# EAGLE design mirror watchwinder (EAGLE 8.2.2)
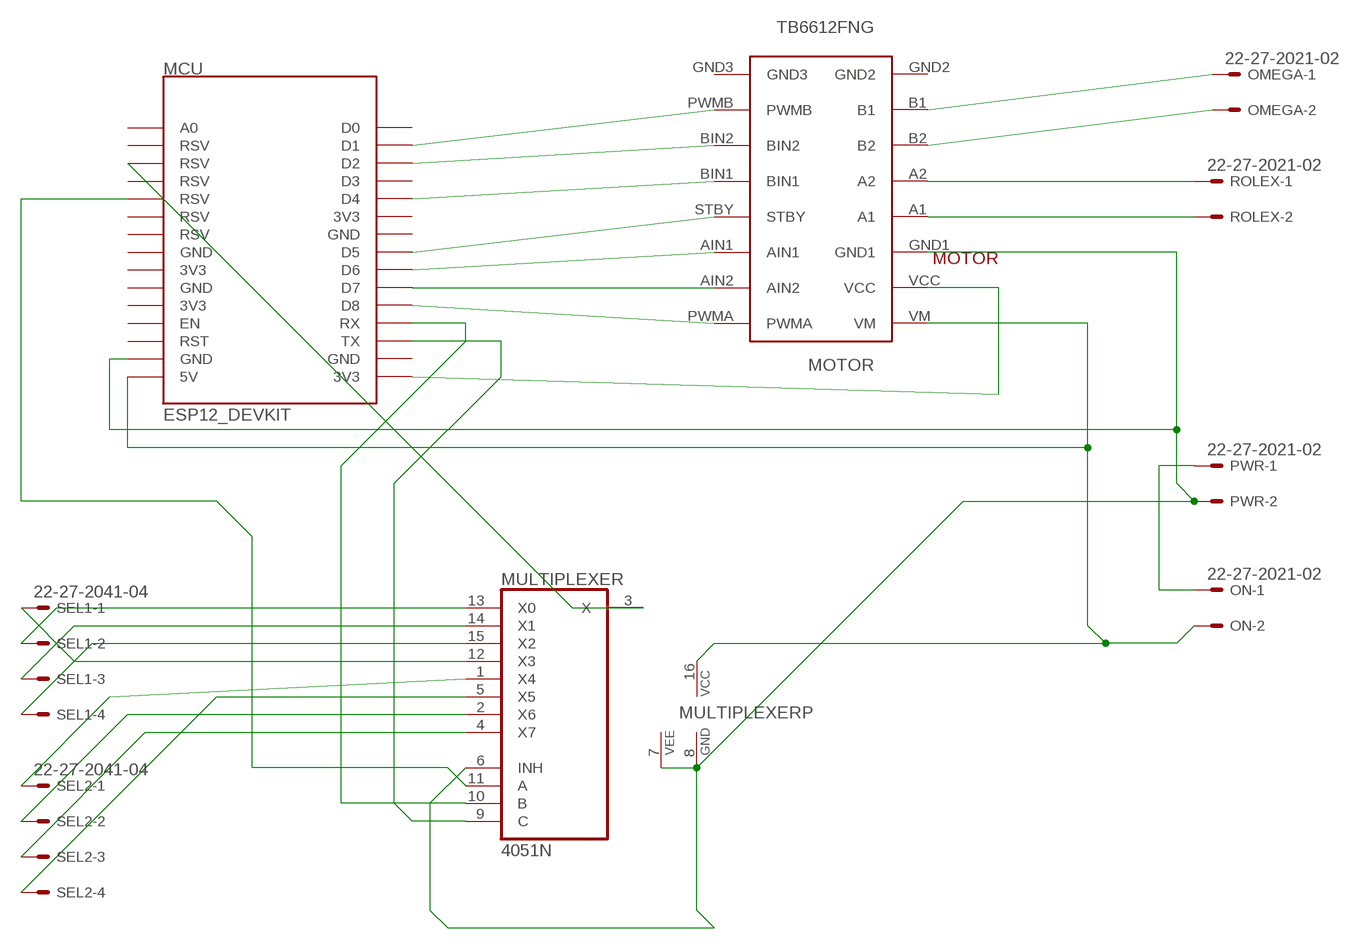
[diagram p0: schematic, sheet 1]

## Parts
MCU  ESP12_DEVKIT  [ESP12_DEVKIT]
MOTOR  TB6612FNG  [TB6612FNG]
MULTIPLEXER  4051N  [DIL16]
OMEGA  22-27-2021-02  [6410-02]
ON  22-27-2021-02  [6410-02]
PWR  22-27-2021-02  [6410-02]
ROLEX  22-27-2021-02  [6410-02]
SEL1  22-27-2041-04  [6410-04]
SEL2  22-27-2041-04  [6410-04]

## Nets
GND: MCU.GND@1(GND) MOTOR.GND1 MULTIPLEXER.6(INH) MULTIPLEXER.7(VEE) MULTIPLEXER.8(GND) PWR.2
N$1: MCU.D1 MOTOR.PWMB
N$2: MCU.D2 MOTOR.BIN2
N$3: MCU.D4 MOTOR.BIN1
N$4: MCU.D5 MOTOR.STBY
N$5: MCU.D6 MOTOR.AIN1
N$6: MCU.D7 MOTOR.AIN2
N$7: MCU.D8 MOTOR.PWMA
N$8: MOTOR.A2 ROLEX.1
N$9: MOTOR.A1 ROLEX.2
N$10: MOTOR.B1 OMEGA.1
N$11: MOTOR.B2 OMEGA.2
N$12: MCU.3V3@2(3V3) MOTOR.VCC
N$13: ON.1 PWR.1
N$14: MCU.5V MOTOR.VM MULTIPLEXER.16(VCC) ON.2
N$16: MULTIPLEXER.12(X3) SEL1.1
N$17: MULTIPLEXER.14(X1) SEL1.3
N$18: MULTIPLEXER.15(X2) SEL1.4
N$19: MULTIPLEXER.13(X0) SEL1.2
N$20: MULTIPLEXER.1(X4) SEL2.1
N$21: MULTIPLEXER.2(X6) SEL2.2
N$22: MULTIPLEXER.4(X7) SEL2.3
N$23: MULTIPLEXER.5(X5) SEL2.4
N$24: MCU.RX MULTIPLEXER.10(B)
N$25: MCU.RSV@3(RSV) MULTIPLEXER.11(A)
N$26: MCU.TX MULTIPLEXER.9(C)
N$27: MCU.RSV@1(RSV) MULTIPLEXER.3(X)
Unconnected: MCU.3V3@0(3V3) MCU.3V3@1(3V3) MCU.3V3@3(3V3) MCU.A0 MCU.D0 MCU.D3 MCU.EN MCU.GND@0(GND) MCU.GND@2(GND) MCU.GND@3(GND) MCU.GND@4(GND) MCU.RST MCU.RSV@0(RSV) MCU.RSV@2(RSV) MCU.RSV@4(RSV) MCU.RSV@5(RSV) MOTOR.GND2 MOTOR.GND3

## Library data of the parts
MCU = ESP12_DEVKIT:ESP12_DEVKIT: ESP12 DEVKIT BOARD
MOTOR = TB6612FNG:TB6612FNG
MULTIPLEXER = 40xx:4051: 8-channel ANALOG MULTIPLEXER
OMEGA ON PWR ROLEX = con-molex:22-?-02: CONNECTOR wire to board 2.54 mm (.1 inch) pitch header; OC_FARNELL: unknown; OC_NEWARK: unknown
SEL1 SEL2 = con-molex:22-?-04: CONNECTOR wire to board 2.54 mm (.1 inch) pitch header; OC_FARNELL: unknown; OC_NEWARK: unknown

## Net classes
0 default: width 0.508 mm

## Board
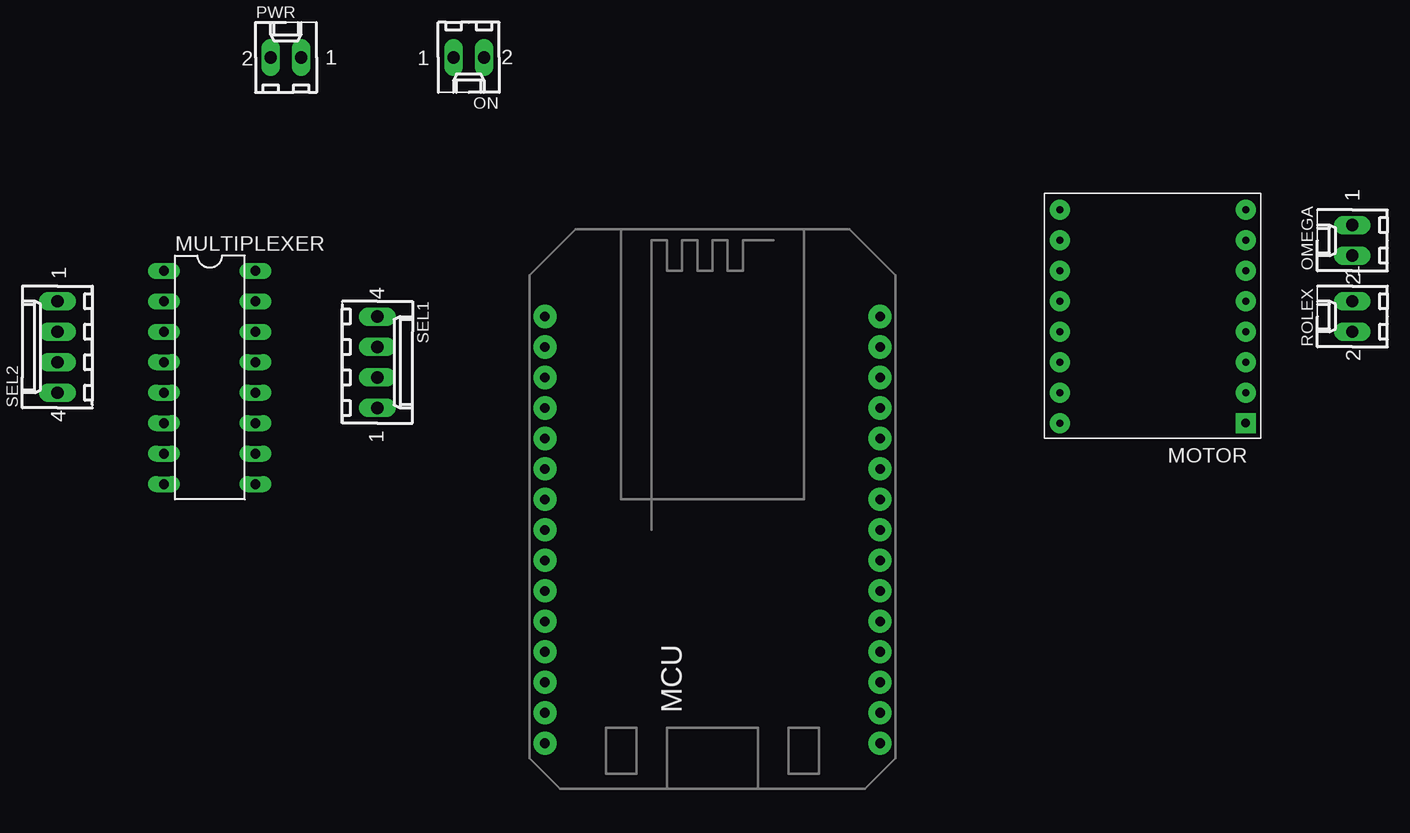
[diagram p1: board, top side]
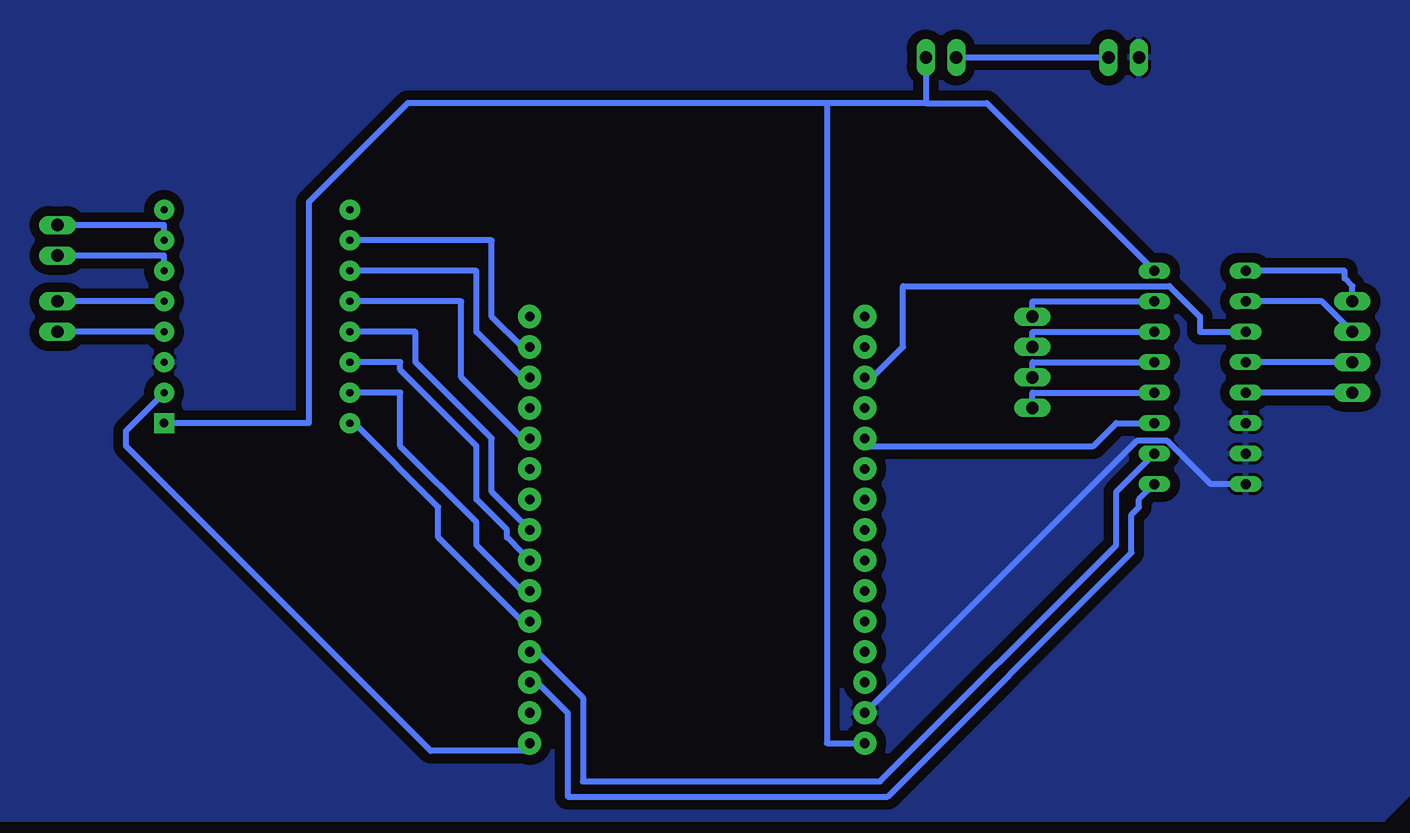
[diagram p2: board, bottom side, seen from below]

No outline drawn. Coordinates in mm, seen from the top.
Copper layers (1*16): Top 0.035mm / dielectric 1.5mm / Bottom 0.035mm
Design rules "default *": minimum track width 20mil, minimum drill 0.35mm, track to track 20mil, track to pad 6mil, pad to pad 6mil, via to via 20mil, smd to smd 6mil, copper to edge 40mil, drill to drill 6mil, minimum pad ring 10mil, minimum via ring 8mil, stop-mask expansion 4mil, vias tented up to drill 0mil, thermal gap 10mil

### Footprints (pad centres in the part's own frame; a part is rotated, then mirrored left to right if it is on the bottom)
ESP12_DEVKIT = drill 0.8 pad 1.93: 3V3@0 -13.97,-7.62; 3V3@1 13.97,5.08; 3V3@2 13.97,-17.78; 3V3@3 -13.97,-2.54; 5V -13.97,-17.78; A0 -13.97,17.78; D0 13.97,17.78; D1 13.97,15.24; D2 13.97,12.7; D3 13.97,10.16; D4 13.97,7.62; D5 13.97,0; D6 13.97,-2.54; D7 13.97,-5.08; D8 13.97,-7.62; EN -13.97,-10.16; GND@0 -13.97,-5.08; GND@1 -13.97,-15.24; GND@2 13.97,2.54; GND@3 13.97,-15.24; GND@4 -13.97,0; RST -13.97,-12.7; RSV@0 -13.97,15.24; RSV@1 -13.97,12.7; RSV@2 -13.97,10.16; RSV@3 -13.97,7.62; RSV@4 -13.97,5.08; RSV@5 -13.97,2.54; RX 13.97,-10.16; TX 13.97,-12.7
TB6612FNG = drill 0.6 pad 1.676: A1 -7.62,-1.27; A2 -7.62,-3.81; AIN1 7.874,1.27; AIN2 7.874,3.81; B1 -7.62,-8.89; B2 -7.62,-6.35; BIN1 7.874,-3.81; BIN2 7.874,-6.35; GND1 -7.62,1.27; GND2 -7.62,-11.43; GND3 7.874,-11.43; PWMA 7.874,6.35; PWMB 7.874,-8.89; STBY 7.874,-1.27; VCC -7.62,3.81 | drill 0.7 pad 1.676 square: VM -7.62,6.35
DIL16 = drill 0.813 long: 1 -8.89,-3.81; 2 -6.35,-3.81; 3 -3.81,-3.81; 4 -1.27,-3.81; 5 1.27,-3.81; 6 3.81,-3.81; 7 6.35,-3.81; 8 8.89,-3.81; 9 8.89,3.81; 10 6.35,3.81; 11 3.81,3.81; 12 1.27,3.81; 13 -1.27,3.81; 14 -3.81,3.81; 15 -6.35,3.81; 16 -8.89,3.81
6410-02 = drill 1.016 long: 1 1.27,0; 2 -1.27,0
6410-04 = drill 1.016 long: 1 3.81,0; 2 1.27,0; 3 -1.27,0; 4 -3.81,0

### Placement (x,y rotation side)
MCU  60.96,29.21 0 top
MOTOR  97.79,44.45 180 top
MULTIPLEXER  19.05,41.91 270 top
OMEGA  114.3,53.34 90 top
ON  40.64,68.58 180 top
PWR  25.4,68.58 0 top
ROLEX  114.3,46.99 90 top
SEL1  33.02,43.18 270 top
SEL2  6.35,44.45 90 top

### Tracks (layer width: path | path; a pad name or v marks a point on that pad's centre or on a via)
GND
  Bottom 0.508: 47.62,13.97 MCU.GND@1 24.33,36.63 21.76,36.63 18.15,33.02 MULTIPLEXER.8
  pour Bottom (isolate 0.813): 1.27,74.93 1.27,7.62 3.81,5.08 120.65,5.08 120.65,74.93
N$1
  Bottom 0.508: MOTOR.PWMB 78.11,53.34 78.11,46.99 75.56,44.45 MCU.D1
N$2
  Bottom 0.508: MOTOR.BIN2 79.38,50.8 79.38,45.72 75.56,41.91 MCU.D2
N$3
  Bottom 0.508: MOTOR.BIN1 80.64,48.26 80.64,41.91 75.56,36.83 MCU.D4
N$4
  Bottom 0.508: MOTOR.STBY 84.45,45.72 84.45,43.18 78.11,36.83 78.11,32.38 75.56,29.84 74.93,29.84 MCU.D5
N$5
  Bottom 0.508: MOTOR.AIN1 85.72,43.18 85.72,42.55 79.38,36.2 79.38,31.75 76.83,29.21 76.83,28.57 75.56,27.3 74.93,27.3 MCU.D6
N$6
  Bottom 0.508: MOTOR.AIN2 85.72,40.64 85.72,36.2 79.38,29.84 79.38,27.94 75.56,24.13 MCU.D7
N$7
  Bottom 0.508: MCU.D8 75.56,21.59 82.55,28.57 82.55,31.11 89.53,38.1 MOTOR.PWMA
N$8
  Bottom 0.508: MOTOR.A2 ROLEX.1
N$9
  Bottom 0.508: MOTOR.A1 ROLEX.2
N$10
  Bottom 0.508: OMEGA.1 105.41,54.61 MOTOR.B1
N$11
  Bottom 0.508: OMEGA.2 105.41,52.07 MOTOR.B2
N$12
  Bottom 0.508: MOTOR.VCC 108.58,37.47 108.58,36.2 83.19,10.79 74.93,10.79 MCU.3V3@2
N$13
  Bottom 0.508: ON.1 PWR.1
N$14
  Bottom 0.508: MULTIPLEXER.16 36.83,64.77 41.91,64.77 | ON.2 41.91,64.77 | MOTOR.VM 93.34,38.1 93.34,56.52 85.09,64.77 50.16,64.77 | 41.91,64.77 50.16,64.77 | MCU.5V 50.16,11.43 50.16,64.77
N$16
  Bottom 0.508: MULTIPLEXER.12 33.02,40.64 SEL1.1
N$17
  Bottom 0.508: MULTIPLEXER.14 33.02,45.72 SEL1.3
N$18
  Bottom 0.508: MULTIPLEXER.15 33.02,48.26 SEL1.4
N$19
  Bottom 0.508: MULTIPLEXER.13 33.02,43.18 SEL1.2
N$20
  Bottom 0.508: MULTIPLEXER.1 6.99,50.8 6.99,50.16 6.35,49.53 SEL2.1
N$21
  Bottom 0.508: MULTIPLEXER.2 8.89,48.26 SEL2.2
N$22
  Bottom 0.508: SEL2.3 MULTIPLEXER.4
N$23
  Bottom 0.508: SEL2.4 MULTIPLEXER.5
N$24
  Bottom 0.508: MULTIPLEXER.10 26.04,32.38 26.04,27.94 45.72,8.26 70.48,8.26 70.48,15.24 74.3,19.05 MCU.RX
N$25
  Bottom 0.508: MULTIPLEXER.11 26.04,38.1 27.94,36.2 46.99,36.2 MCU.RSV@3
N$26
  Bottom 0.508: MULTIPLEXER.9 24.13,31.75 24.13,31.11 24.77,30.48 24.77,27.3 45.09,6.99 71.75,6.99 71.75,13.97 74.3,16.51 MCU.TX
N$27
  Bottom 0.508: MULTIPLEXER.3 19.05,45.72 19.05,46.99 21.59,49.53 43.81,49.53 43.81,44.45 46.35,41.91 MCU.RSV@1